# Altium schematic sheet EDP_Retrofit.SchDoc
size A3; SheetNumber: 1; SheetTotal: 1
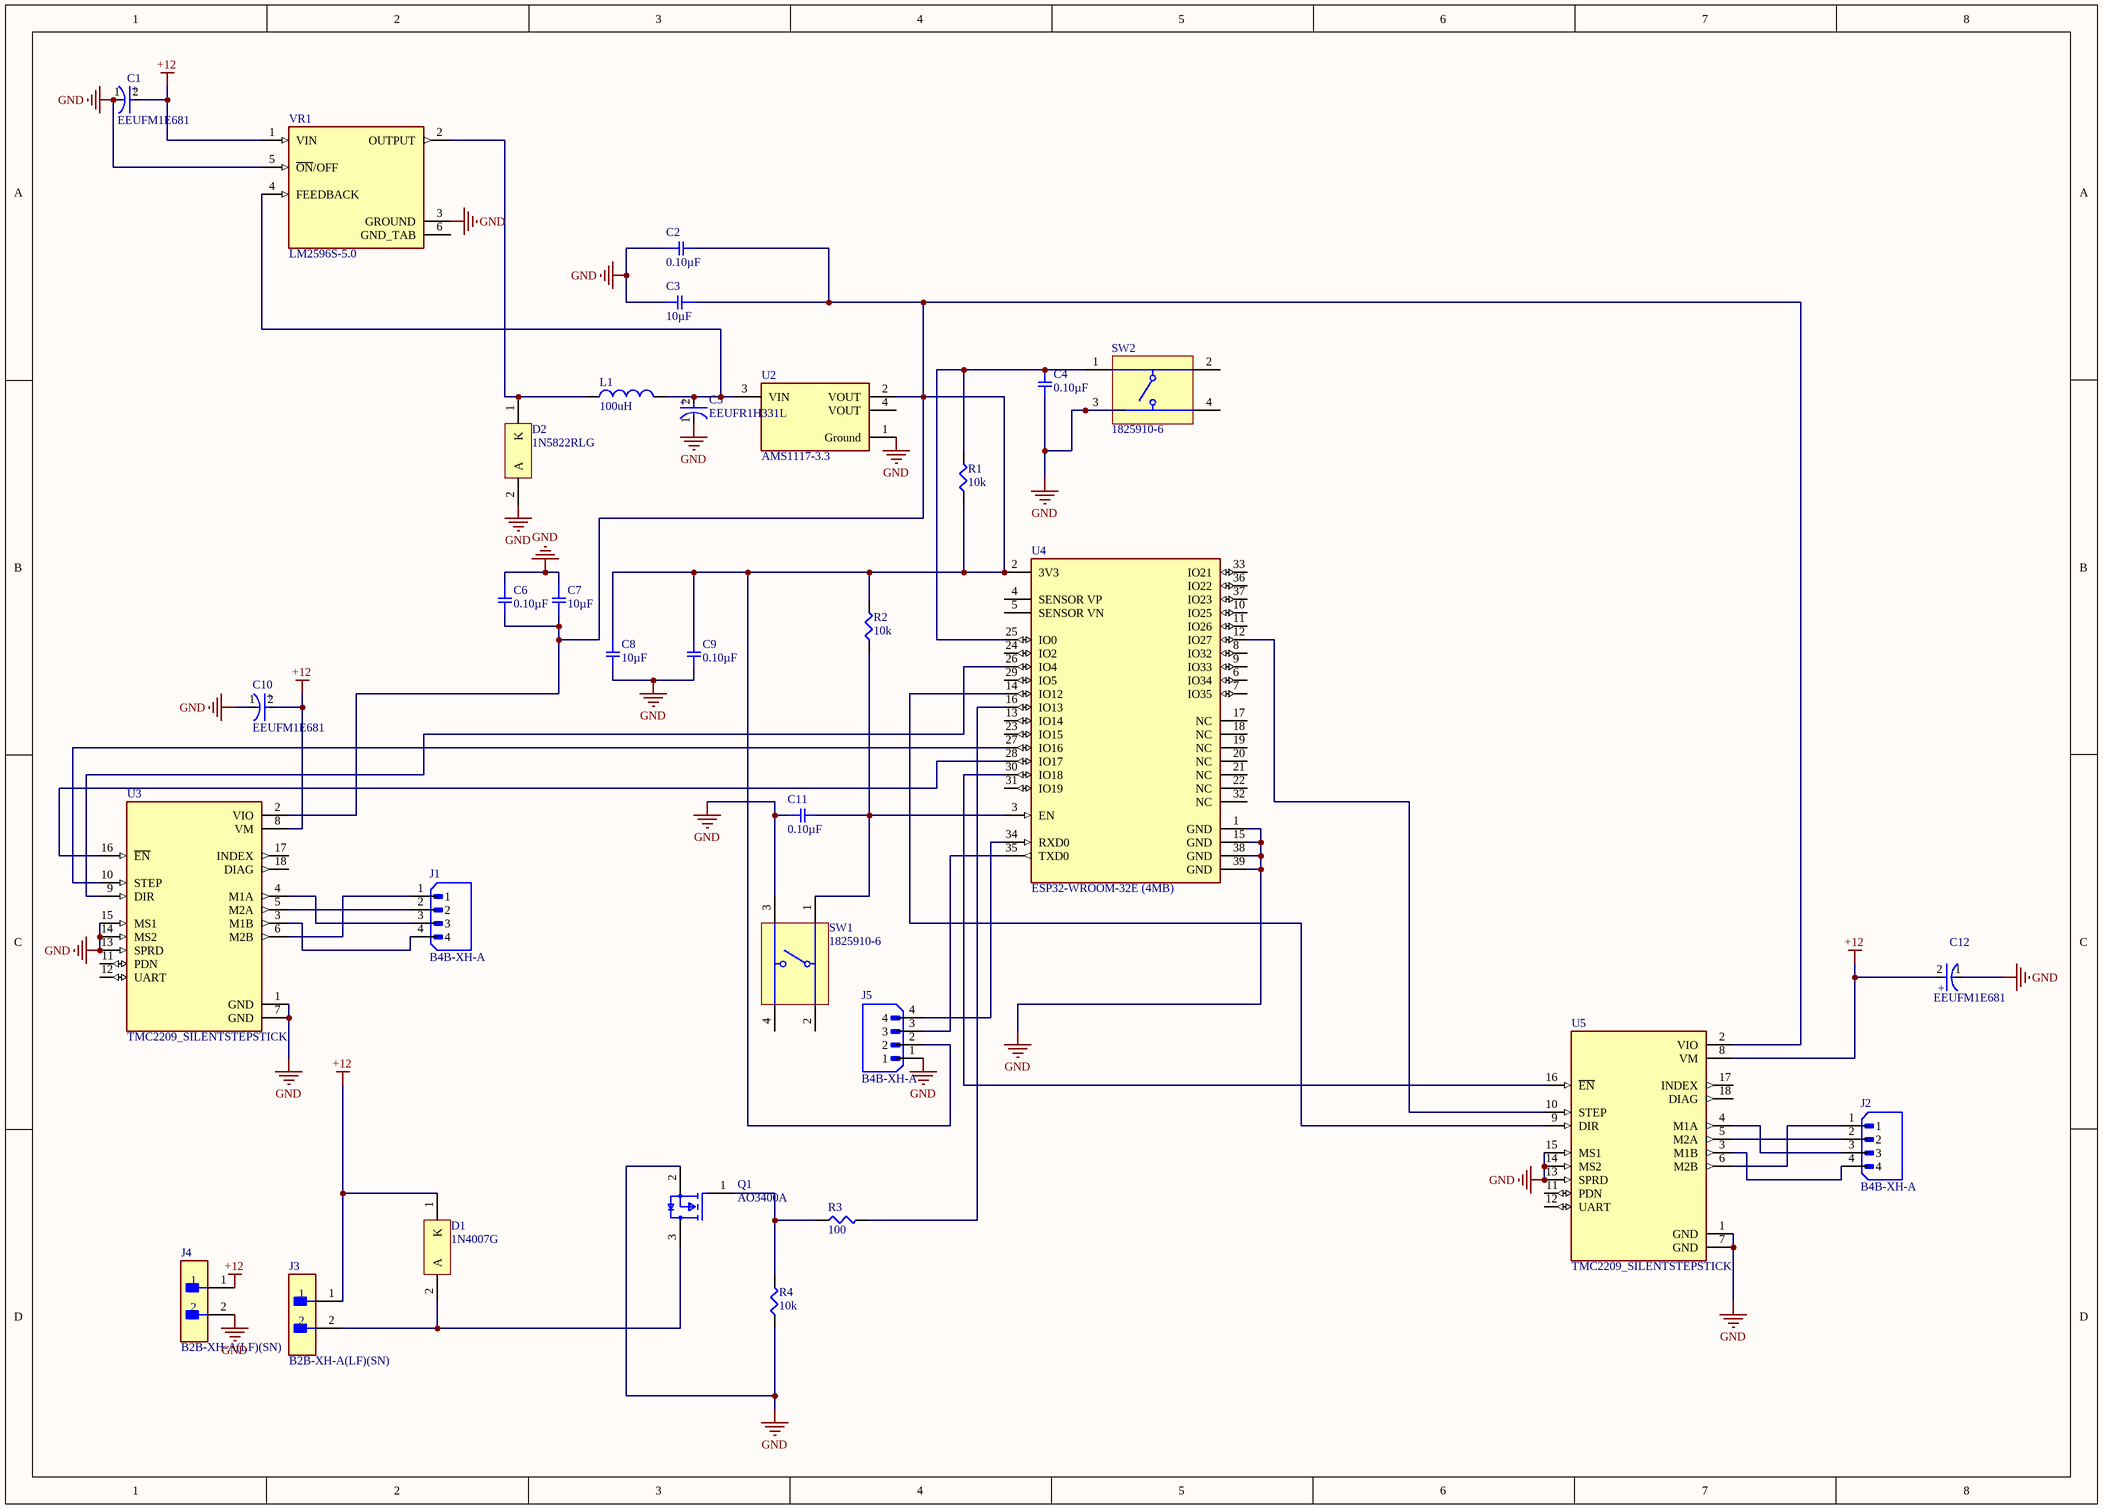
[diagram p0: EDP_Retrofit.SchDoc]

## Parts
C1  EEUFM1E681  [FP-RAD-TH-D_10_0_5-L_20_2-MFG]
C2  0.10µF  [SMD-0805C]
C3  10µF  [SMD-0805C]
C4  0.10µF  [SMD-0805C]
C5  EEUFR1H331L  [FP-RAD-TH-D_10_0_5-L_25_2-MFG]
C6  0.10µF  [SMD-0805C]
C7  10µF  [SMD-0805C]
C8  10µF  [SMD-0805C]
C9  0.10µF  [SMD-0805C]
C10  EEUFM1E681  [FP-RAD-TH-D_10_0_5-L_20_2-MFG]
C11  0.10µF  [SMD-0805C]
C12  EEUFM1E681  [FP-RAD-TH-D_10_0_5-L_20_2-MFG]
D1  1N4007G  [ONSC-AXIAL_LEAD-2-59-10_P]
D2  1N5822RLG  [ONSC-AXIAL_LEAD-2-267-05_V]
J1  B4B-XH-A  [JST_B4B-XH-A]
J2  B4B-XH-A  [JST_B4B-XH-A]
J3  B2B-XH-A(LF)(SN)  [FP-B2B-XH-A_LF_SN-MFG]
J4  B2B-XH-A(LF)(SN)  [FP-B2B-XH-A_LF_SN-MFG]
J5  B4B-XH-A  [JST_B4B-XH-A]
L1  100uH  [MY_0805]
Q1  AO3400A  [FP-SOT23-MFG]
R1  10k  [SMD-0805-RES]
R2  10k  [SMD-0805-RES]
R3  100  [SMD-0805-RES]
R4  10k  [SMD-0805-RES]
SW1  1825910-6  [TECO-1825910-6_V]
SW2  1825910-6  [TECO-1825910-6_V]
U2  AMS1117-3.3  [FP-AMS1117-IPC_C]
U3  TMC2209_SILENTSTEPSTICK  [MODULE_TMC2209_SILENTSTEPSTICK]
U4  ESP32-WROOM-32E (4MB)  [FP-ESP32-WROOM-32E_4MB-MFG]
U5  TMC2209_SILENTSTEPSTICK  [MODULE_TMC2209_SILENTSTEPSTICK]
VR1  LM2596S-5.0  [TO170P1524X483-6N]

## Nets
+12: C1.2(A) C10.2(A) C12.2(A) D1.1(K) J3.1 J4.1 U3.8(VM) U5.8(VM) VR1.1(VIN)
GND: C1.1(C) C2.1 C3.2 C4.2 C5.1(C) C6.1 C7.1 C8.2 C9.2 C10.1(C) C11.1 C12.1(C) D2.2(A) J4.2 J5.1 Q1.2(S) R4.1 SW1.3 SW2.3 U2.1(Ground) U3.1(GND) U3.7(GND) U3.13(SPRD) U3.14(MS2) U3.15(MS1) U4.1(GND) U4.15(GND) U4.38(GND) U4.39(GND) U5.1(GND) U5.7(GND) U5.13(SPRD) U5.14(MS2) U5.15(MS1) VR1.3(GROUND) VR1.5(~{ON}/OFF)
NetC2_2: C2.2 C3.1 C6.2 C7.2 C8.1 C9.1 J5.2 R1.1 R2.2 U2.2(VOUT) U3.2(VIO) U4.2(3V3) U5.2(VIO)
NetC4_1: C4.1 R1.2 SW2.1 U4.25(IO0)
NetC5_2: C5.2(A) L1.2 U2.3(VIN) VR1.4(FEEDBACK)
NetC11_2: C11.2 R2.1 SW1.1 U4.3(EN)
NetD1_2: D1.2(A) J3.2 Q1.3(D)
NetD2_1: D2.1(K) L1.1 VR1.2(OUTPUT)
NetJ1_1: J1.1 U3.6(M2B)
NetJ1_2: J1.2 U3.5(M2A)
NetJ1_3: J1.3 U3.4(M1A)
NetJ1_4: J1.4 U3.3(M1B)
NetJ2_1: J2.1 U5.6(M2B)
NetJ2_2: J2.2 U5.5(M2A)
NetJ2_3: J2.3 U5.4(M1A)
NetJ2_4: J2.4 U5.3(M1B)
NetJ5_3: J5.3 U4.35(TXD0)
NetJ5_4: J5.4 U4.34(RXD0)
NetQ1_1: Q1.1(G) R3.1 R4.2
NetR3_2: R3.2 U4.16(IO13)
NetU3_9: U3.9(DIR) U4.26(IO4)
NetU3_10: U3.10(STEP) U4.27(IO16)
NetU3_16: U3.16(~{EN}) U4.28(IO17)
NetU4_12: U4.12(IO27) U5.10(STEP)
NetU4_14: U4.14(IO12) U5.9(DIR)
NetU4_30: U4.30(IO18) U5.16(~{EN})

Not connected (* = marked no-connect by the designer): SW1 2 4; SW2 2 4; U2 4(VOUT); U3 11(PDN) 12(UART) 17(INDEX) 18(DIAG); U4 4(SENSOR_VP) 5(SENSOR_VN) 6(IO34) 7(IO35) 8(IO32) 9(IO33) 10(IO25) 11(IO26) 13(IO14) 17(NC) 18(NC) 19(NC) 20(NC) 21(NC) 22(NC) 23(IO15) 24(IO2) 29(IO5) 31(IO19) 32(NC) 33(IO21) 36(IO22) 37(IO23); U5 11(PDN) 12(UART) 17(INDEX) 18(DIAG); VR1 6(GND_TAB)

## Notes on the sheet
- (in symbol CMP-05427-000254-1) +
- (in symbol CMP-05427-000865-1) +

## Library data of the parts
C1 C10 C12 = CMP-05427-000865-1: Aluminum Electrolytic Capacitors (Radial Lead Type) 680uF ±20% 25V; Dissipation Factor: 0.14%; Lead Diameter: 0.6mm; Ripple Current: 2.18A; Polarity: Polar; Life (Hours): 5000Hour; Impedance: 19mR; Dielectric Material: Aluminium; Radiation Hardening: No; Voltage: 25V; Lead Pitch: 5mm; Package Quantity: 200; Height: 20mm; Diameter: 10mm; Lead Free: Lead Free; RoHS Compliant: Yes; Min Operating Temperature: -40°C; REACH SVHC: No SVHC; Construction: RADIAL; Height - Seated (Max): 0.866inch; Packaging: Bulk; Voltage Rating: 25V; Case/Package: Radial; Voltage Rating (DC): 25V; Tolerance: 20%; Capacitance: 680uF; Max Operating Temperature: 105°C; Length: 20mm; Series: FM; Mount: Through Hole; Termination: Radial; ESR (Equivalent Series Resistance): 19mR
C2 C4 C6 C9 C11 = GRM21BR71E104KA01L: CAP CER 0.1UF 25V X7R 0805; Manufacturer: Murata Electronics North America; Factory Stock: 0; Unit Price (USD): 0.19; Minimum Quantity: 1; Tolerance: ±10%; Datasheets: http://www.murata.com/~/media/webrenewal/support/library/catalog/products/capacitor/mlcc/c02e.pdf; Image: //media.digikey.com/Renders/Murata%20Renders/0805%20(2012%20Metric)%20.85mm.jpg; Digi-Key Part Number: 490-1673-1-ND; Part Number: GRM21BR71E104KA01L; Quantity Available: 1009396; @ qty: 0; Packaging: Cut Tape (CT); Series: GRM; Part Status: Active; Value: 0.10µF; Voltage: 25V; Temperature Coefficient: X7R; Operating Temperature: -55°C ~ 125°C; Features: -; Ratings: -; Applications: General Purpose; Mounting Type: Surface Mount, MLCC; Package / Case: 0805 (2012 Metric); Size / Dimension: 0.079" L x 0.049" W (2.00mm x 1.25mm); Height - Seated (Max): -; Thickness (Max): 0.053" (1.35mm); Lead Spacing: -; Lead Style: -
C3 C7 C8 = GCJ21BR71A106KE01L: CAP CER 10UF 10V X7R 0805; Manufacturer: Murata Electronics North America; Factory Stock: 0; Unit Price (USD): 0.56; Minimum Quantity: 1; Tolerance: ±10%; Datasheets: http://www.murata.com/~/media/webrenewal/support/library/catalog/products/capacitor/mlcc/c03e.ashx; Image: //media.digikey.com/Renders/Murata%20Renders/0805%20(2012%20Metric)%20.85mm.jpg; Digi-Key Part Number: 490-12646-1-ND; Part Number: GCJ21BR71A106KE01L; Quantity Available: 2702; @ qty: 0; Packaging: Cut Tape (CT); Series: GCJ; Part Status: Active; Value: 10µF; Voltage: 10V; Temperature Coefficient: X7R; Operating Temperature: -55°C ~ 125°C; Features: Soft Termination; Ratings: AEC-Q200; Applications: Automotive, Boardflex Sensitive; Mounting Type: Surface Mount, MLCC; Package / Case: 0805 (2012 Metric); Size / Dimension: 0.079" L x 0.049" W (2.00mm x 1.25mm); Height - Seated (Max): -; Thickness (Max): 0.057" (1.45mm); Lead Spacing: -; Lead Style: -
C5 = CMP-05427-000254-1: Aluminum Electrolytic Capacitors (Radial Lead Type) 330uF ±20% 50V
D1 = CMP-0902-00143-1: Standard Recovery Rectifier, 2-Pin Axial_Lead, Pb-Free, Bulk Bag; Manufacturer: On Semiconductor; VRRM Max (V): 1000; IFSM Max (A): 30; IO(rec) Max (A): 1; ComponentLink2Description: Datasheet; ComponentLink2URL: http://www.onsemi.com/pub_link/Collateral/1N4001-D.PDF; PackageDescription: 2-Pin, Axial Lead, Diameter 2.35 mm; PartNumber: 1N4007G; ComponentLink1URL: http://www.onsemi.com/; ComponentLink3URL: http://www.onsemi.cn/pub_link/Collateral/59-10.PDF; PackageReference: AXIAL_LEAD-2-59-10; ComponentLink1Description: Manufacturer URL; Mounting Technology: Through Hole; ComponentLink3Description: Package Specification; Packing: Bulk Bag; PackageVersion: Rev. U, 02/2005; DatasheetVersion: Rev. 13; RoHS: TRUE; Type: Standard Recovery
D2 = CMP-1055-00010-1: Rectifier, 2-Pin Axial_Lead, Pb-Free, Tape and Reel; Manufacturer: On Semiconductor; Configuration: Single; IFSM Max (A): 80; ComponentLink2URL: http://www.onsemi.cn/pub_link/Collateral/1N5820-D.PDF; Packing: Tape and Reel; ComponentLink1Description: Manufacturer URL; PackageDescription: 2-Pin, Axial Lead, Diameter 5.05 mm; ComponentLink3Description: Package Specification; PackageReference: AXIAL_LEAD-2-267-05; PartNumber: 1N5822RLG; PackageVersion: Rev. G, 06/2000; ComponentLink1URL: http://www.onsemi.com/; ComponentLink2Description: Datasheet; RoHS: TRUE; Mounting Technology: Through Hole; DatasheetVersion: Rev. 10; ComponentLink3URL: http://www.onsemi.com/pub_link/Collateral/267-05.PDF
J1 J2 J5 = B4B-XH-A: Connector Header Through Hole 4 position 0.098 (2.50mm); MF: JST Sales; SnapEDA_Link: https://www.snapeda.com/parts/B4B-XH-A/JST/view-part/?ref=snap; Package: None; Value: *; MP: B4B-XH-A; Check_prices: https://www.snapeda.com/parts/B4B-XH-A/JST/view-part/?ref=eda
J3 J4 = CMP-2000-05888-3: CONN HEADER VERT 2POS 2.5MM; Current Rating: 3A; Voltage Rating: 250V; Number of Contacts: 2; Contact Resistance: 20mR; Wire/Cable Gauge: 22AWG; Insulation Resistance: 1GR; Connector Type: Male Pin; Packaging: Bulk; Contact Material: Brass; Lead Free: Lead Free; Orientation: Straight; Contact Plating: Tin; Max Current Rating: 3A; Termination: Solder; Fastening Type: Detent; Depth: 5.75mm; Housing Material: Polyamide; REACH SVHC: No SVHC; Series: XH; Voltage Rating (AC): 250V; Number of Positions: 2; Color: Natural; Contact Type: Male Pin; Max Voltage Rating (DC): 250V; Pitch: 2.5mm; Lead Pitch: 2.5mm; Mount: Through Hole; Max Operating Temperature: 85°C; Length: 7.4mm; Max Voltage Rating (AC): 250V; Min Operating Temperature: -25°C; Number of Rows: 1; Housing Color: White
L1 = Inductor: ASiD Part Number: Inductor-AS; Current: 1A; Value: 100uH
Q1 = CMP-83955-000006-1: MOSFET N-CH 30V 5.7A SOT23; Input Capacitance: 630pF; Number of Elements: 1; Rds On Max: 26.5mR; Max Power Dissipation: 1.4W; Gate to Source Voltage (Vgs): 12V; Min Operating Temperature: -55°C; Lead Free: Lead Free; Number of Pins: 3; Drain to Source Voltage (Vdss): 30V; Case/Package: SOT-23; Mount: Surface Mount; Continuous Drain Current (ID): 5.7A; Radiation Hardening: No; Packaging: Tape and Reel; Max Operating Temperature: 150°C; Power Dissipation: 1.4W
R1 R2 R4 = ERJ-6ENF1002V: RES SMD 10K OHM 1% 1/8W 0805; Manufacturer: Panasonic Electronic Components; Factory Stock: 0; Unit Price (USD): 0.00729; @ qty: 1500; Minimum Quantity: 1; Power (Watts): 0.125W, 1/8W; Temperature Coefficient: ±100ppm/°C; Part Number: ERJ-6ENF1002V; Datasheets: http://industrial.panasonic.com/www-cgi/jvcr13pz.cgi?E+PZ+3+AOA0002+ERJ6ENF1002V+7+WW; Image: //media.digikey.com/Renders/Panasonic%20Renders/ERJ-0805%20Pkg.jpg; Digi-Key Part Number: P10.0KCCT-ND; Quantity Available: 3985614; Packaging: Cut Tape (CT); Series: ERJ; Part Status: Active; Value: 10k; Tolerance: ±1%; Composition: Thick Film; Features: Automotive AEC-Q200; Operating Temperature: -55°C ~ 155°C; Package / Case: 0805 (2012 Metric); Supplier Device Package: 0805; Size / Dimension: 0.079" L x 0.049" W (2.00mm x 1.25mm); Height - Seated (Max): 0.028" (0.70mm); Number of Terminations: 2; Failure Rate: -
R3 = ERJ-6ENF1000V: RES SMD 100 OHM 1% 1/8W 0805; Manufacturer: Panasonic Electronic Components; Factory Stock: 0; Unit Price (USD): 0.00729; @ qty: 1500; Minimum Quantity: 1; Power (Watts): 0.125W, 1/8W; Temperature Coefficient: ±100ppm/°C; Part Number: ERJ-6ENF1000V; Datasheets: http://industrial.panasonic.com/www-cgi/jvcr13pz.cgi?E+PZ+3+AOA0002+ERJ6ENF1000V+7+WW; Image: //media.digikey.com/Renders/Panasonic%20Renders/ERJ-0805%20Pkg.jpg; Digi-Key Part Number: P100CCT-ND; Quantity Available: 288663; Packaging: Cut Tape (CT); Series: ERJ; Part Status: Active; Value: 100; Tolerance: ±1%; Composition: Thick Film; Features: Automotive AEC-Q200; Operating Temperature: -55°C ~ 155°C; Package / Case: 0805 (2012 Metric); Supplier Device Package: 0805; Size / Dimension: 0.079" L x 0.049" W (2.00mm x 1.25mm); Height - Seated (Max): 0.028" (0.70mm); Number of Terminations: 2; Failure Rate: -
SW1 SW2 = CMP-1684-00021-1: Tact Switch, SPST-NO, 0.05 A, -35 to 85 degC, 4-Pin THD, RoHS, Bulk; Manufacturer: TE Connectivity; Maximum Contact Resistance: 100mOhm; Mechanical Life: 100000Cycles; Bushing Type: Unthreaded; Switch Configuration: OFF(ON); Maximum DC Voltage Rating: 24V; Contact Rating @ Voltage: 0.05A@24VDC; Actuator Color: Black; Body Orientation: Straight; Function: MomentaryContact; Illumination: N/R; Actuator Style: RoundButton; Actuator Material: PolybutyleneTerephthalate; Dielectric Strength: 500VAC; Pole Throw Configuration: SPST; Actuator Length: 1.4mm; Product Weight: N/A; Contact Material: CopperAlloy; Housing Material: N/A; Terminal Type: PCPins; Minimum Insulation Resistance: 100MOhm; Package Description: 4-Pin Through Hole Device, Body 5.99 x 5.99 mm, Pitch 6.5 mm; Part No: 1825910-6; Package Reference: THD; Base Material: N/A; Manufacturer URL: http://www.te.com; Contact Plating: Silver; RoHS: Yes; Datasheet Version: Rev. C9; Electrical Life: 100000Cycles; Maximum AC Voltage Rating: N/A; Thread Size: N/R; Operating Temperature: -35to85C; Mounting: ThroughHole; Dimension: 5.99x5mm; Datasheet URL: http://www.te.com/commerce/DocumentDelivery/DDEController?Action=showdoc&DocId=Customer+Drawing%7F1825910%7FC9%7Fpdf%7FEnglish%7FENG_CD_1825910_C9.pdf%7F1825910-6; Family: 1825910; Seal Location: N/A; Seal Description: N/A; Packaging: N/A
U2 = CMP-209535-000001-1: LDO Voltage Regulators 1A, 3.3V; Manufacturer: Advanced Monolithic Systems; Dropout Voltage: 1.1V; Output Type: Fixed; Nominal Supply Current: 5mA; Max Power Dissipation: 1.2W; Max Supply Voltage: 15V; Number Of Outputs: 1; Standoff Height: 0.64mm; Max Junction Temp: +125°C; Height: 1.8mm; Package: AMS1117; Device Class L2: Power Management ICs; ComponentLink2Description: Datasheet; ComponentLink2URL: http://www.advanced-monolithic.com/pdf/ds1117.pdf; Category: IC; RoHS: TRUE; Automotive: No; Device Class L1: Integrated Circuits (ICs); Output Current: 1A; Device Class L3: Voltage Regulators - Linear; Temperature: -40°C to +125°C; Output Voltage: 3.3V; Manufacturer Part Number: AMS1117-3.3; Temperature Range Low: -40°C; Octopart: https://octopart.com/ams1117-3.3-advanced+monolithic+systems-25899300; Lead Free: Yes; Ipc Land Pattern Name: SOT229P700X180-4; Temperature Range High: +125°C
U3 U5 = TMC2209_SILENTSTEPSTICK: TMC2209 Motor Controller/Driver Power Management Evaluation Board; MF: Trinamic Motion Control GmbH; MP: TMC2209 SILENTSTEPSTICK; SnapEDA_Link: https://www.snapeda.com/parts/TMC2209%20SILENTSTEPSTICK/Trinamic/view-part/?ref=snap; Package: None; Value: *; Check_prices: https://www.snapeda.com/parts/TMC2209%20SILENTSTEPSTICK/Trinamic/view-part/?ref=eda
U4 = CMP-194065-000026-1: RX TXRX MOD WIFI TRACE ANT SMD
VR1 = LM2596S-5.0: SIMPLE SWITCHERÂ® 4.5V to 40V, 3A Low Component Count Step-Down Regulator; MF: Texas Instruments; MP: LM2596S-5.0/NOPB; SnapEDA_Link: https://www.snapeda.com/parts/LM2596S-5.0/NOPB/Texas+Instruments/view-part/?ref=snap; Package: TO-263-5 Texas Instruments; Value: *; Check_prices: https://www.snapeda.com/parts/LM2596S-5.0/NOPB/Texas+Instruments/view-part/?ref=eda